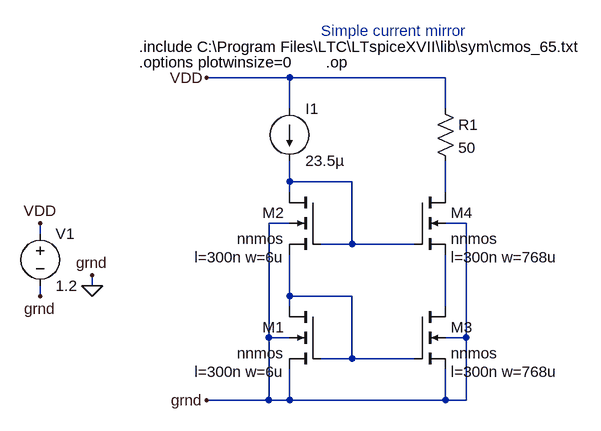
[diagram p0: schematic simple_current_mirror.asc]
simple_current_mirror.asc, the LTspice schematic file:
Version 4
SHEET 1 880 680
WIRE -16 80 -144 80
WIRE 224 80 -16 80
WIRE -16 128 -16 80
WIRE 224 128 224 80
WIRE -16 240 -16 208
WIRE 80 240 -16 240
WIRE -16 256 -16 240
WIRE 224 256 224 208
WIRE -16 304 -48 304
WIRE 256 304 224 304
WIRE -400 320 -400 304
WIRE 80 336 80 240
WIRE 80 336 32 336
WIRE 176 336 80 336
WIRE -320 400 -320 384
WIRE -400 416 -400 400
WIRE -16 416 -16 352
WIRE 80 416 -16 416
WIRE -16 432 -16 416
WIRE 224 432 224 352
WIRE -48 480 -48 304
WIRE -16 480 -48 480
WIRE 256 480 256 304
WIRE 256 480 224 480
WIRE 80 512 80 416
WIRE 80 512 32 512
WIRE 176 512 80 512
WIRE -48 576 -48 480
WIRE -48 576 -144 576
WIRE -16 576 -16 528
WIRE -16 576 -48 576
WIRE 224 576 224 528
WIRE 224 576 -16 576
WIRE 256 576 256 480
WIRE 256 576 224 576
FLAG -320 400 0
FLAG -320 384 grnd
FLAG -400 416 grnd
FLAG -400 304 VDD
FLAG -144 80 VDD
FLAG -144 576 grnd
SYMBOL nmos4 32 432 M0
WINDOW 123 56 100 Left 2
SYMATTR InstName M1
SYMATTR Value nnmos
SYMATTR Value2 l=300n w=6u
SYMBOL nmos4 32 256 M0
WINDOW 123 56 100 Left 2
SYMATTR InstName M2
SYMATTR Value nnmos
SYMATTR Value2 l=300n w=6u
SYMBOL nmos4 176 432 R0
WINDOW 123 56 100 Left 2
SYMATTR InstName M3
SYMATTR Value nnmos
SYMATTR Value2 l=300n w=768u
SYMBOL nmos4 176 256 R0
WINDOW 123 56 100 Left 2
SYMATTR InstName M4
SYMATTR Value nnmos
SYMATTR Value2 l=300n w=768u
SYMBOL current -16 128 R0
WINDOW 123 0 0 Left 0
WINDOW 39 0 0 Left 0
SYMATTR InstName I1
SYMATTR Value 23.5µ
SYMBOL voltage -400 304 R0
WINDOW 123 0 0 Left 0
WINDOW 39 0 0 Left 0
SYMATTR InstName V1
SYMATTR Value 1.2
SYMBOL res 208 112 R0
SYMATTR InstName R1
SYMATTR Value 50
TEXT 32 8 Left 2 ;Simple current mirror
TEXT -248 32 Left 2 !.include C:\\Program Files\\LTC\\LTspiceXVII\\lib\\sym\\cmos_65.txt
TEXT -248 56 Left 2 !.options plotwinsize=0
TEXT 40 56 Left 2 !.op

The netlist it stands for:
* simple_current_mirror.asc
M1 N003 N003 0 0 nnmos l=300n w=6u
M2 N001 N001 N003 0 nnmos l=300n w=6u
M3 N004 N003 0 0 nnmos l=300n w=768u
M4 N002 N001 N004 0 nnmos l=300n w=768u
I1 VDD N001 23.5µ
V1 VDD 0 1.2
R1 VDD N002 50
.model NMOS NMOS
.model PMOS PMOS
.lib standard.mos
* Simple current mirror
.include C:\Program Files\LTC\LTspiceXVII\lib\sym\cmos_65.txt
.options plotwinsize=0
.op
.backanno
.end